# Altium project tinker3_zynq.PrjPcb
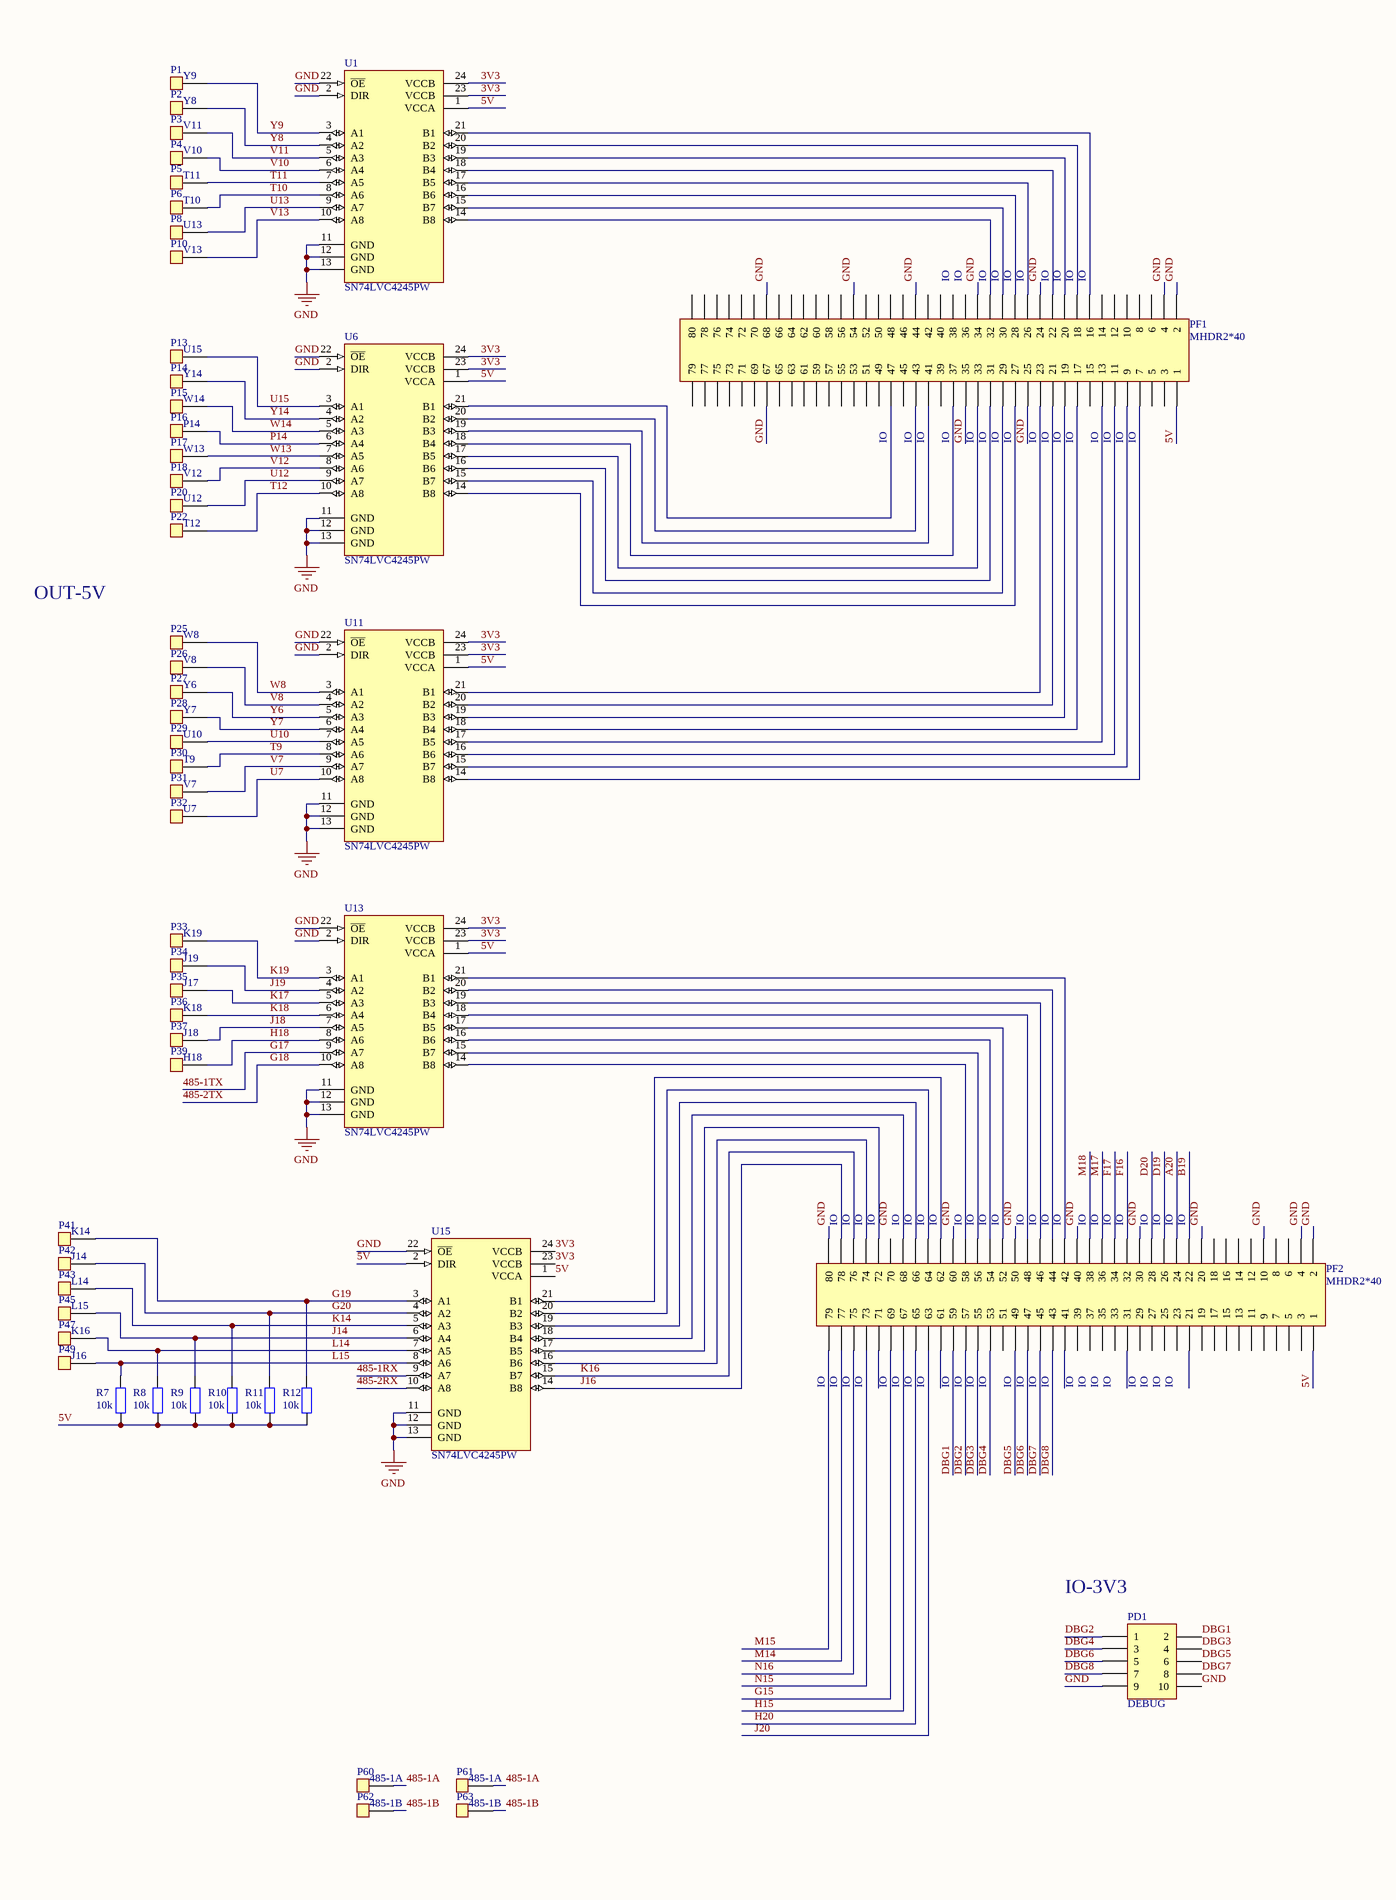
[diagram p0: zynqBoard.SchDoc, left]
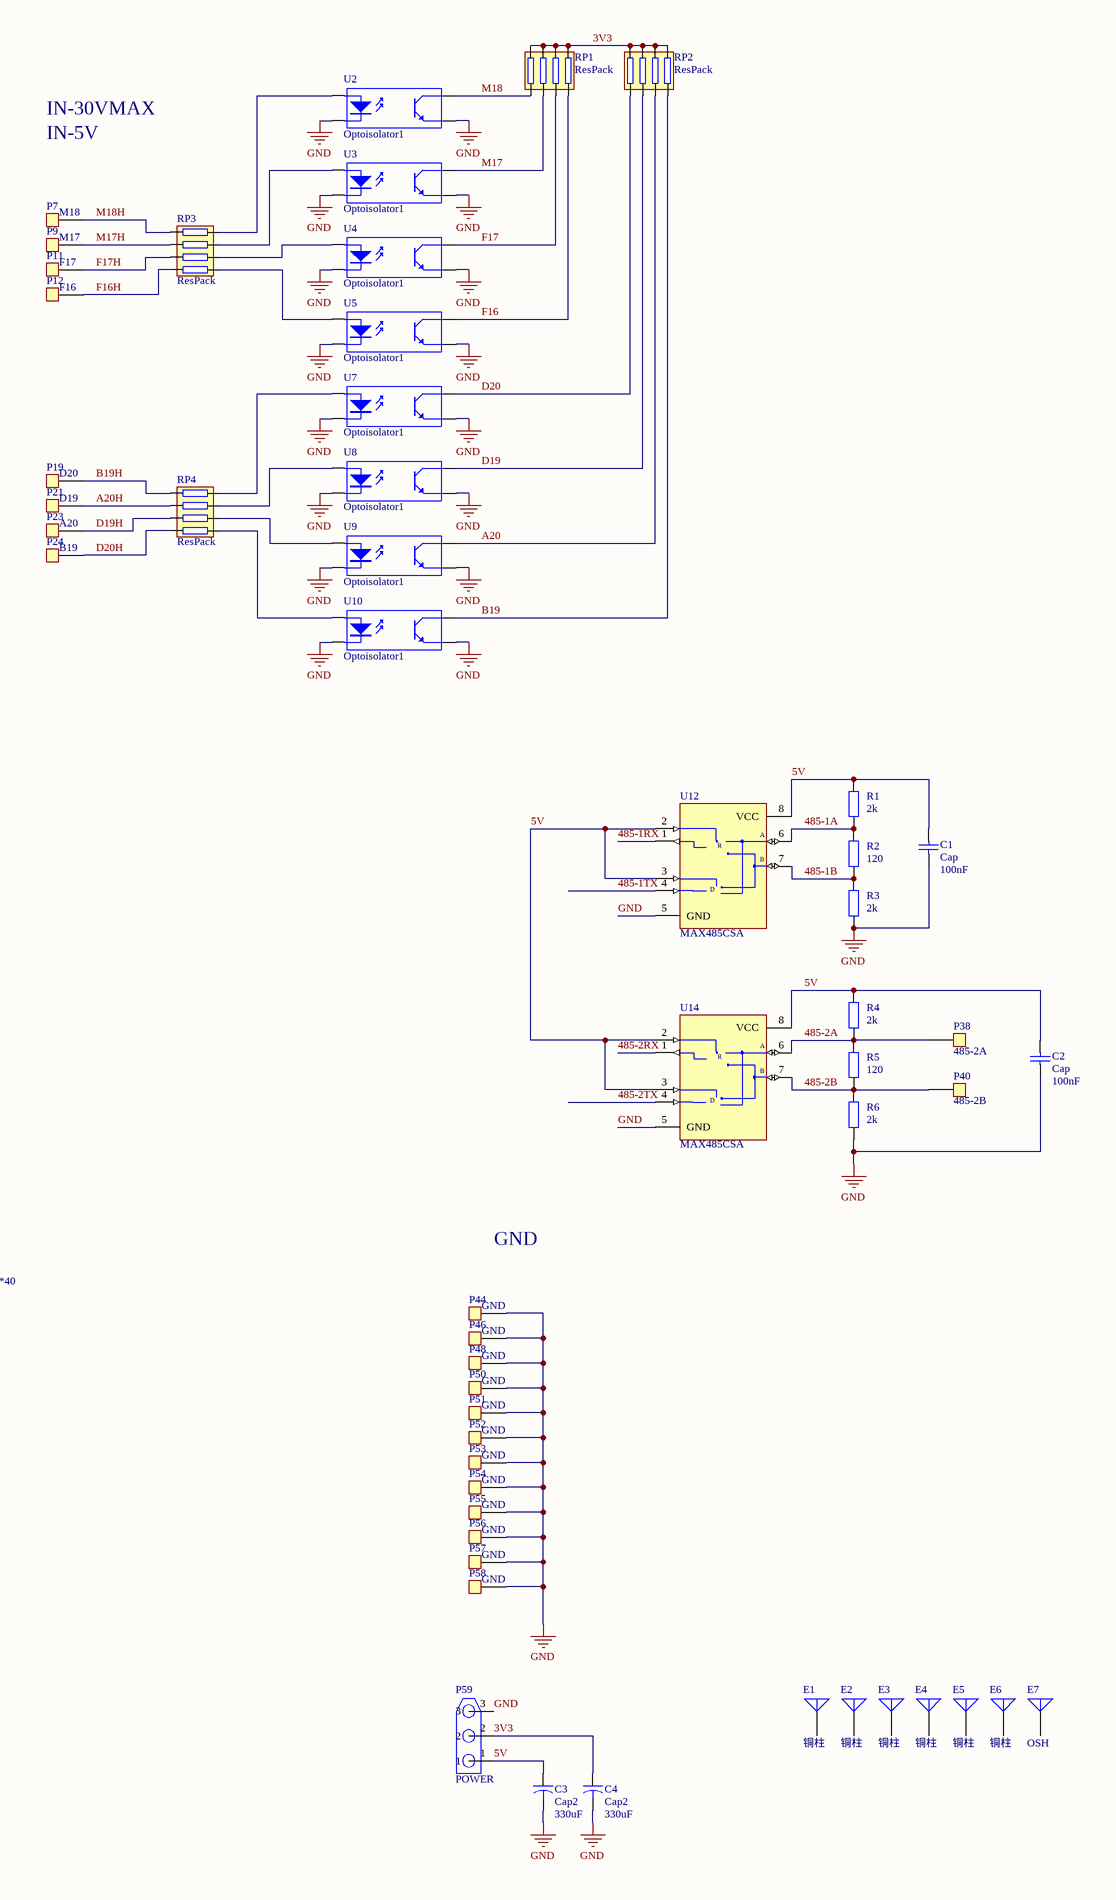
[diagram p1: zynqBoard.SchDoc, right]
1 sheet, 108 parts. Net scope: global (net labels, ports and power ports of the same name join across sheets).
Board file: zynqBoard.PcbDoc

## Sheet zynqBoard.SchDoc
size A2

### Parts
C1  Cap  value 100nF  [1608[0603]big]
C2  Cap  value 100nF  [1608[0603]big]
C3  Cap2  value 330uF  [AVX_D_7343-31]
C4  Cap2  value 330uF  [AVX_D_7343-31]
E1  铜柱  [铜柱孔]
E2  铜柱  [铜柱孔]
E3  铜柱  [铜柱孔]
E4  铜柱  [铜柱孔]
E5  铜柱  [铜柱孔]
E6  铜柱  [铜柱孔]
E7  OSH  [OPENSOURECE]
P1  Y9  [HEADER_5.08MM_SINGLE]
P2  Y8  [HEADER_5.08MM_SINGLE]
P3  V11  [HEADER_5.08MM_SINGLE]
P4  V10  [HEADER_5.08MM_SINGLE]
P5  T11  [HEADER_5.08MM_SINGLE]
P6  T10  [HEADER_5.08MM_SINGLE]
P7  M18  [HEADER_5.08MM_SINGLE]
P8  U13  [HEADER_5.08MM_SINGLE]
P9  M17  [HEADER_5.08MM_SINGLE]
P10  V13  [HEADER_5.08MM_SINGLE]
P11  F17  [HEADER_5.08MM_SINGLE]
P12  F16  [HEADER_5.08MM_SINGLE]
P13  U15  [HEADER_5.08MM_SINGLE]
P14  Y14  [HEADER_5.08MM_SINGLE]
P15  W14  [HEADER_5.08MM_SINGLE]
P16  P14  [HEADER_5.08MM_SINGLE]
P17  W13  [HEADER_5.08MM_SINGLE]
P18  V12  [HEADER_5.08MM_SINGLE]
P19  D20  [HEADER_5.08MM_SINGLE]
P20  U12  [HEADER_5.08MM_SINGLE]
P21  D19  [HEADER_5.08MM_SINGLE]
P22  T12  [HEADER_5.08MM_SINGLE]
P23  A20  [HEADER_5.08MM_SINGLE]
P24  B19  [HEADER_5.08MM_SINGLE]
P25  W8  [HEADER_5.08MM_SINGLE]
P26  V8  [HEADER_5.08MM_SINGLE]
P27  Y6  [HEADER_5.08MM_SINGLE]
P28  Y7  [HEADER_5.08MM_SINGLE]
P29  U10  [HEADER_5.08MM_SINGLE]
P30  T9  [HEADER_5.08MM_SINGLE]
P31  V7  [HEADER_5.08MM_SINGLE]
P32  U7  [HEADER_5.08MM_SINGLE]
P33  K19  [HEADER_5.08MM_SINGLE]
P34  J19  [HEADER_5.08MM_SINGLE]
P35  J17  [HEADER_5.08MM_SINGLE]
P36  K18  [HEADER_5.08MM_SINGLE]
P37  J18  [HEADER_5.08MM_SINGLE]
P38  485-2A  [HEADER_5.08MM_SINGLE]
P39  H18  [HEADER_5.08MM_SINGLE]
P40  485-2B  [HEADER_5.08MM_SINGLE]
P41  K14  [HEADER_5.08MM_SINGLE]
P42  J14  [HEADER_5.08MM_SINGLE]
P43  L14  [HEADER_5.08MM_SINGLE]
P44  GND  [HEADER_5.08MM_SINGLE]
P45  L15  [HEADER_5.08MM_SINGLE]
P46  GND  [HEADER_5.08MM_SINGLE]
P47  K16  [HEADER_5.08MM_SINGLE]
P48  GND  [HEADER_5.08MM_SINGLE]
P49  J16  [HEADER_5.08MM_SINGLE]
P50  GND  [HEADER_5.08MM_SINGLE]
P51  GND  [HEADER_5.08MM_SINGLE]
P52  GND  [HEADER_5.08MM_SINGLE]
P53  GND  [HEADER_5.08MM_SINGLE]
P54  GND  [HEADER_5.08MM_SINGLE]
P55  GND  [HEADER_5.08MM_SINGLE]
P56  GND  [HEADER_5.08MM_SINGLE]
P57  GND  [HEADER_5.08MM_SINGLE]
P58  GND  [HEADER_5.08MM_SINGLE]
P59  POWER  [MR30]
P60  485-1A  [HEADER_5.08MM_SINGLE]
P61  485-1A  [HEADER_5.08MM_SINGLE]
P62  485-1B  [HEADER_5.08MM_SINGLE]
P63  485-1B  [HEADER_5.08MM_SINGLE]
PD1  DEBUG  [HDR2X5]
PF1  MHDR2*40  [sbMHeader2*40]
PF2  MHDR2*40  [sbMHeader2*40]
R1  value 2k  [1608[0603]big]  (hidden comment: Res2)
R2  value 120  [1608[0603]big]  (hidden comment: Res2)
R3  value 2k  [1608[0603]big]  (hidden comment: Res2)
R4  value 2k  [1608[0603]big]  (hidden comment: Res2)
R5  value 120  [1608[0603]big]  (hidden comment: Res2)
R6  value 2k  [1608[0603]big]  (hidden comment: Res2)
R7  value 10k  [1608[0603]big]
R8  value 10k  [1608[0603]big]
R9  value 10k  [1608[0603]big]
R10  value 10k  [1608[0603]big]
R11  value 10k  [1608[0603]big]
R12  value 10k  [1608[0603]big]
RP1  ResPack  [LC-0603_Rx4]
RP2  ResPack  [LC-0603_Rx4]
RP3  ResPack  [LC-0603_Rx4]
RP4  ResPack  [LC-0603_Rx4]
U1  SN74LVC4245PW  [PW024]
U2  Optoisolator1  [LC-SMD-4]
U3  Optoisolator1  [LC-SMD-4]
U4  Optoisolator1  [LC-SMD-4]
U5  Optoisolator1  [LC-SMD-4]
U6  SN74LVC4245PW  [PW024]
U7  Optoisolator1  [LC-SMD-4]
U8  Optoisolator1  [LC-SMD-4]
U9  Optoisolator1  [LC-SMD-4]
U10  Optoisolator1  [LC-SMD-4]
U11  SN74LVC4245PW  [PW024]
U12  MAX485CSA  [NSO8_N]
U13  SN74LVC4245PW  [PW024]
U14  MAX485CSA  [NSO8_N]
U15  SN74LVC4245PW  [PW024]

### Nets
GND: C1.1 C2.1 C3.2 C4.2 P44.1 P46.1 P48.1 P50.1 P51.1 P52.1 P53.1 P54.1 P55.1 P56.1 P57.1 P58.1 P59.3 PD1.9 PD1.10 PF1.2 PF1.4 PF1.24 PF1.25 PF1.34 PF1.35 PF1.44 PF1.54 PF1.67 PF1.68 PF2.2 PF2.4 PF2.10 PF2.20 PF2.30 PF2.40 PF2.50 PF2.60 PF2.80 R3.1 R6.1 U1.2(DIR) U1.11(GND) U1.12(GND) U1.13(GND) U1.22(~{OE}) U2.2(K) U2.3(E) U3.2(K) U3.3(E) U4.2(K) U4.3(E) U5.2(K) U5.3(E) U6.2(DIR) U6.11(GND) U6.12(GND) U6.13(GND) U6.22(~{OE}) U7.2(K) U7.3(E) U8.2(K) U8.3(E) U9.2(K) U9.3(E) U10.2(K) U10.3(E) U11.2(DIR) U11.11(GND) U11.12(GND) U11.13(GND) U11.22(~{OE}) U12.5(GND) U13.2(DIR) U13.11(GND) U13.12(GND) U13.13(GND) U13.22(~{OE}) U14.5(GND) U15.11(GND) U15.12(GND) U15.13(GND) U15.22(~{OE})
3V3: C4.1 P59.2 RP1.5 RP1.6 RP1.7 RP1.8 RP2.5 RP2.6 RP2.7 RP2.8 U1.23(VCCB) U1.24(VCCB) U6.23(VCCB) U6.24(VCCB) U11.23(VCCB) U11.24(VCCB) U13.23(VCCB) U13.24(VCCB) U15.23(VCCB) U15.24(VCCB)
5V: C1.2 C2.2 C3.1 P59.1 PF1.1 PF2.1 R1.2 R4.2 R7.1 R8.1 R9.1 R10.1 R11.1 R12.1 U1.1(VCCA) U6.1(VCCA) U11.1(VCCA) U12.2(~{RE}) U12.3(DE) U12.8(VCC) U13.1(VCCA) U14.2(~{RE}) U14.3(DE) U14.8(VCC) U15.1(VCCA) U15.2(DIR)
485-1A: P60.1 P61.1 R1.1 R2.2 U12.6(A)
485-1B: P62.1 P63.1 R2.1 R3.2 U12.7(B)
485-1RX: U12.1(RO) U15.9(A7)
485-1TX: U12.4(DI) U13.9(A7)  [also labelled G17]
485-2A: P38.1 R4.1 R5.2 U14.6(A)
485-2B: P40.1 R5.1 R6.2 U14.7(B)
485-2RX: U14.1(RO) U15.10(A8)
485-2TX: U13.10(A8) U14.4(DI)  [also labelled G18]
A20: PF2.24 RP2.3 U9.4(C)
A20H: P21.1 RP4.7
B19: PF2.22 RP2.4 U10.4(C)
B19H: P19.1 RP4.8
D19: PF2.26 RP2.2 U8.4(C)
D19H: P23.1 RP4.6
D20: PF2.28 RP2.1 U7.4(C)
D20H: P24.1 RP4.5
DBG1: PD1.2 PF2.59
DBG2: PD1.1 PF2.57
DBG3: PD1.4 PF2.55
DBG4: PD1.3 PF2.53
DBG5: PD1.6 PF2.49
DBG6: PD1.5 PF2.47
DBG7: PD1.8 PF2.45
DBG8: PD1.7 PF2.43
F16: PF2.32 RP1.4 U5.4(C)
F16H: P12.1 RP3.5
F17: PF2.34 RP1.3 U4.4(C)
F17H: P11.1 RP3.6
G15: PF2.69
G19: P41.1 R12.2 U15.3(A1)
G20: P42.1 R11.2 U15.4(A2)
H15: PF2.67
H18: P39.1 U13.8(A6)
H20: PF2.65
J14: P45.1 R9.2 U15.6(A4)
J16: PF2.78 U15.14(B8)
J18: P37.1 U13.7(A5)
J19: P34.1 U13.4(A2)
J20: PF2.63
K14: P43.1 R10.2 U15.5(A3)
K16: PF2.76 U15.15(B7)
K17: P35.1 U13.5(A3)
K18: P36.1 U13.6(A4)
K19: P33.1 U13.3(A1)
L14: P47.1 R8.2 U15.7(A5)
L15: P49.1 R7.2 U15.8(A6)
M14: PF2.77
M15: PF2.79
M17: PF2.36 RP1.2 U3.4(C)
M17H: P9.1 RP3.7
M18: PF2.38 RP1.1 U2.4(C)
M18H: P7.1 RP3.8
N15: PF2.73
N16: PF2.75
P14: P16.1 U6.6(A4)
T9: P30.1 U11.8(A6)
T10: P6.1 U1.8(A6)
T11: P5.1 U1.7(A5)
T12: P22.1 U6.10(A8)
U7: P32.1 U11.10(A8)
U10: P29.1 U11.7(A5)
U12: P20.1 U6.9(A7)
U13: P8.1 U1.9(A7)
U15: P13.1 U6.3(A1)
V7: P31.1 U11.9(A7)
V8: P26.1 U11.4(A2)
V10: P4.1 U1.6(A4)
V11: P3.1 U1.5(A3)
V12: P18.1 U6.8(A6)
V13: P10.1 U1.10(A8)
W8: P25.1 U11.3(A1)
W13: P17.1 U6.7(A5)
W14: P15.1 U6.5(A3)
Y6: P27.1 U11.5(A3)
Y7: P28.1 U11.6(A4)
Y8: P2.1 U1.4(A2)
Y9: P1.1 U1.3(A1)
Y14: P14.1 U6.4(A2)
NetPF1_7: PF1.7 U11.14(B8)
NetPF1_9: PF1.9 U11.15(B7)
NetPF1_11: PF1.11 U11.16(B6)
NetPF1_13: PF1.13 U11.17(B5)
NetPF1_16: PF1.16 U1.21(B1)
NetPF1_17: PF1.17 U11.18(B4)
NetPF1_18: PF1.18 U1.20(B2)
NetPF1_19: PF1.19 U11.19(B3)
NetPF1_20: PF1.20 U1.19(B3)
NetPF1_21: PF1.21 U11.20(B2)
NetPF1_22: PF1.22 U1.18(B4)
NetPF1_23: PF1.23 U11.21(B1)
NetPF1_26: PF1.26 U1.17(B5)
NetPF1_27: PF1.27 U6.14(B8)
NetPF1_28: PF1.28 U1.16(B6)
NetPF1_29: PF1.29 U6.15(B7)
NetPF1_30: PF1.30 U1.15(B7)
NetPF1_31: PF1.31 U6.16(B6)
NetPF1_32: PF1.32 U1.14(B8)
NetPF1_33: PF1.33 U6.17(B5)
NetPF1_37: PF1.37 U6.18(B4)
NetPF1_41: PF1.41 U6.19(B3)
NetPF1_43: PF1.43 U6.20(B2)
NetPF1_47: PF1.47 U6.21(B1)
NetPF2_42: PF2.42 U13.21(B1)
NetPF2_44: PF2.44 U13.20(B2)
NetPF2_46: PF2.46 U13.19(B3)
NetPF2_48: PF2.48 U13.18(B4)
NetPF2_52: PF2.52 U13.17(B5)
NetPF2_54: PF2.54 U13.16(B6)
NetPF2_56: PF2.56 U13.15(B7)
NetPF2_58: PF2.58 U13.14(B8)
NetPF2_62: PF2.62 U15.21(B1)
NetPF2_64: PF2.64 U15.20(B2)
NetPF2_66: PF2.66 U15.19(B3)
NetPF2_68: PF2.68 U15.18(B4)
NetPF2_72: PF2.72 U15.17(B5)
NetPF2_74: PF2.74 U15.16(B6)
NetRP3_1: RP3.1 U2.1(A)
NetRP3_2: RP3.2 U3.1(A)
NetRP3_3: RP3.3 U4.1(A)
NetRP3_4: RP3.4 U5.1(A)
NetRP4_1: RP4.1 U7.1(A)
NetRP4_2: RP4.2 U8.1(A)
NetRP4_3: RP4.3 U9.1(A)
NetRP4_4: RP4.4 U10.1(A)

Not connected (* = marked no-connect by the designer): E1 1(A); E2 1(A); E3 1(A); E4 1(A); E5 1(A); E6 1(A); E7 1(A); PF1 3 5 6 8 10 12 14 15 36 38 39 40 42 45 46 48 49 50 51 52 53 55 56 57 58 59 60 61 62 63 64 65 66 69 70 71 72 73 74 75 76 77 78 79 80; PF2 3 5 6 7 8 9 11 12 13 14 15 16 17 18 19 21 23 25 27 29 31 33 35 37 39 41 51 61 70 71

### Notes on the sheet
- IN-5V
- IN-30VMAX
- (near PF1) IO
- IO
- OUT-5V
- (near PF2) IO
- GND
- (near PD1) IO-3V3
- Labels drawn without touching a wire or pin: GND
- (in symbol MAX485CSA) R; D

### Library data of the parts
C1 C2 = Cap: Capacitor; Published: 8-Jun-2000; LatestRevisionDate: 17-Jul-2002; LatestRevisionNote: Re-released for DXP Platform.; PackageReference: RAD-0.3; Publisher: Altium Limited; PackageDescription: Radial Cap, Thru-Hole; 2 Leads; 0.3 in Pin Spacing
C3 C4 = Cap2: Capacitor; Published: 23-Sep-2002; PackageReference: CAPR5-4X5; Publisher: Altium Limited; PackageDescription: Capacitor; 2 Leads
E1-E7 = Antenna: Generic Antenna; Published: 24-Mar-1999; LatestRevisionDate: 17-Jul-2002; LatestRevisionNote: Re-released for DXP Platform.; PackageReference: PIN1; Publisher: Altium Limited
P1-P58 P60-P63 = conn
P59 = XT30-3P
PD1 = Header 5X2: Header, 5-Pin, Dual row; LatestRevisionDate: 17-Jul-2002; LatestRevisionNote: Re-released for DXP Platform.; Publisher: Altium Limited
R1-R12 = Res2: Resistor; Published: 8-Jun-2000; LatestRevisionDate: 17-Jul-2002; LatestRevisionNote: Re-released for DXP Platform.; PackageReference: AXIAL-0.4; Publisher: Altium Limited; PackageDescription: Axial Device, Thru-Hole; 2 Leads; 0.4 in Pin Spacing
RP1-RP4 = ResPackx4
U1 U6 U11 U13 U15 = SN74LVC4245PW: Octal Bus Transceiver and 3.3-V to 5-V Shifter with 3-State Outputs; Published: 8-Jun-2000; LatestRevisionDate: 04-Mar-2005; LatestRevisionNote: Stylized 3D Model Added.; DatasheetVersion: Jan-1997; PackageVersion: Feb-1999; PackageReference: PW024; Publisher: Altium Limited; PackageDescription: Shrink Small Outline; 24 Leads; Body Width 4.4 mm; Pitch 0.65 mm; ComponentLink1Description: Manufacturer Link; ComponentLink1URL: http://www.ti.com/
U2-U5 U7-U10 = Optoisolator1: 4-Pin Phototransistor Optocoupler; Published: 24-Mar-1999; LatestRevisionDate: 04-Mar-2005; LatestRevisionNote: Sch pins 3 & 4 Swapped.; DatasheetVersion: Nov-2003; PackageReference: DIP-4; Publisher: Altium Limited
U12 U14 = MAX485CSA: Low-Power, Slew-Rate-Limited RS-485/RS-422 Transceiver; Published: 16-Jan-2001; LatestRevisionDate: 13-Apr-2006; LatestRevisionNote: IPC-7351 Footprint Added.; DatasheetVersion: Feb-1996; PackageReference: NSO8; Publisher: Altium Limited; PackageDescription: 8-Pin Small Outline Integrated Circuit 1.27 mm Pitch; Code_JEDEC: MS-012-AA; Code_IPC: SOIC127P600-8; ComponentLink1Description: Manufacturer Link; ComponentLink1URL: http://www.maxim-ic.com/; ComponentLink2Description: Datasheet; ComponentLink2URL: http://pdfserv.maxim-ic.com/en/ds/MAX1487-MAX491.pdf